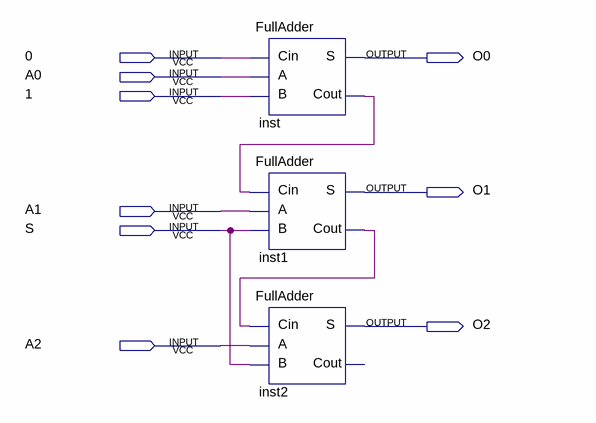
[diagram p0: schematic sheet]
// Quartus schematic hw8p3.bdf as structural Verilog: 3 symbols, 9 pins
module hw8p3 (
  input  \0 ,
  input  A0,
  input  \1 ,
  input  A1,
  input  S,
  input  A2,
  output O0,
  output O1,
  output O2
);

  wire inst1_cout, inst_cout;

  FullAdder inst (.A(A0), .B(\1 ), .Cin(\0 ), .S(O0), .Cout(inst_cout));
  FullAdder inst1 (.A(A1), .B(S), .Cin(inst_cout), .S(O1), .Cout(inst1_cout));
  FullAdder inst2 (.A(A2), .B(S), .Cin(inst1_cout), .S(O2));  // open: Cout
endmodule
